# Altium schematic sheet Audio-Beamformer_Driver_V1.0.SchDoc: Audio-Beamformer
size A4; PageSetup: Record=PageOptions|CenterHorizontal=True|CenterVertical=True|PrintScale=0.97|XCorrection=1.00|YCorrection=1.00|PrintKind=0|BorderSize=5000000|LeftOffset=0|BottomOffset=0|Orientation=2|PaperLength=1000|PaperWidth=1000|Scale=100|PaperSource=7|PrintQuality=-3|MediaType=1|DitherType=10|PrintScaleMode=1|PaperKind=A4|PaperIndex=9; Organization: Ostschweizer Fachhochschule; Address2: Florian Baumgartner & Thierry Schwaller; Address3: florian.baumgartner@ost.ch; DocumentNumber: 5; Revision: V1.0; SheetNumber: 5; SheetTotal: 10; Author: Florian Baumgartner & Thierry Schwaller; Subtitle: H-Bridge Driver
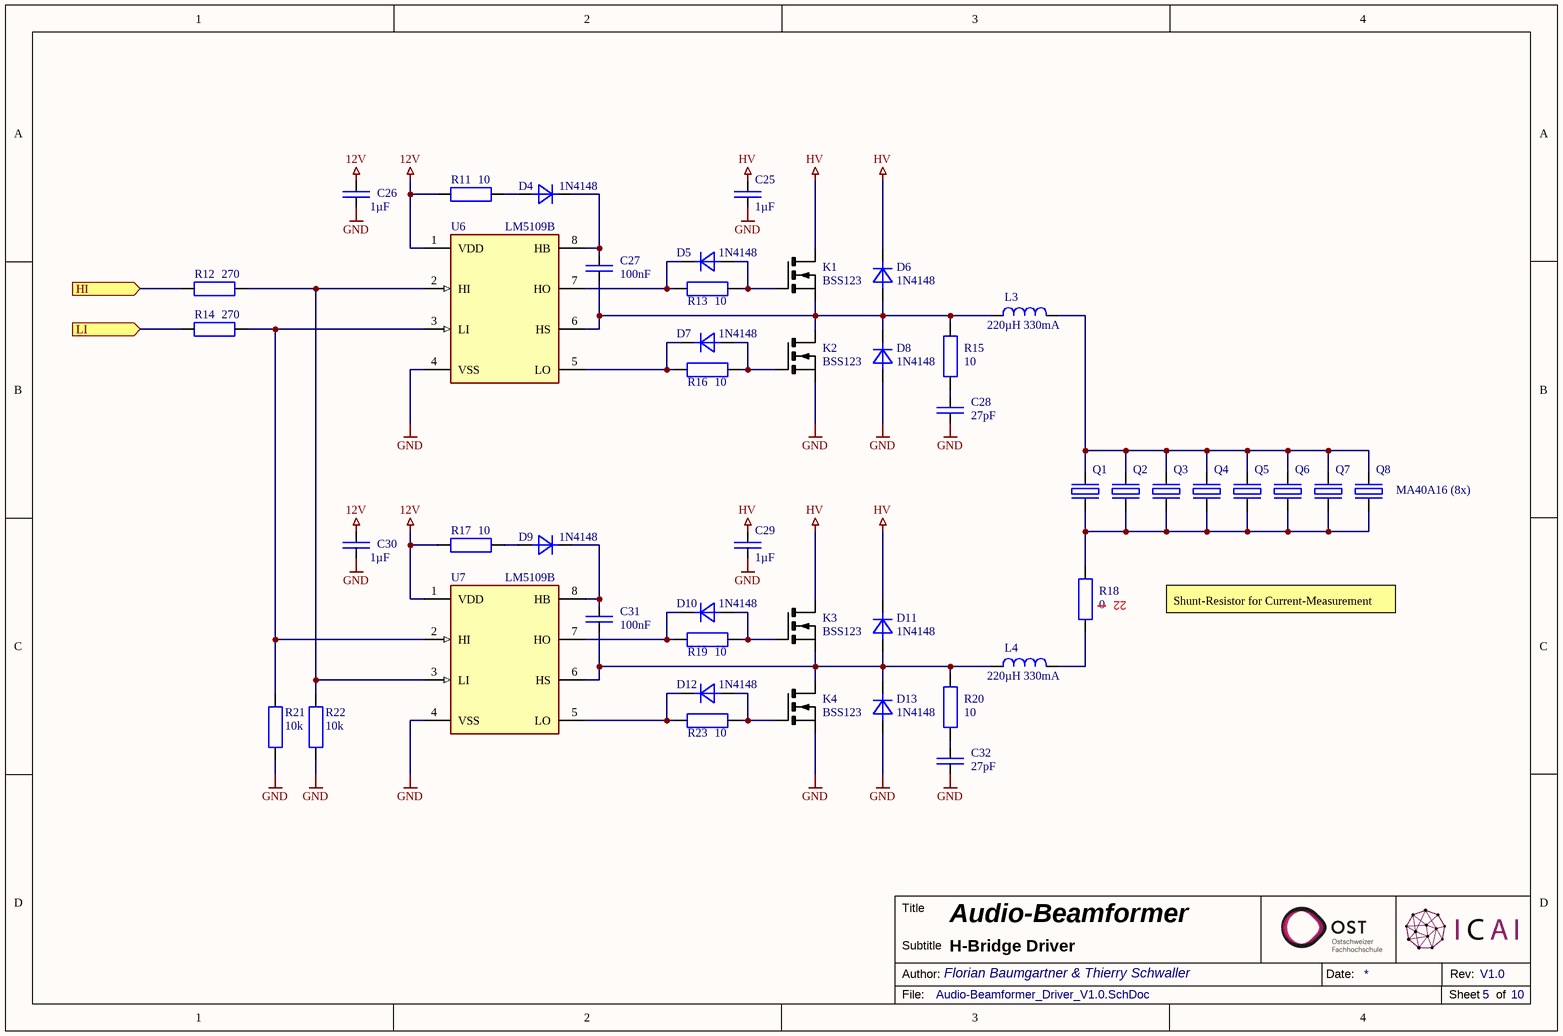
[diagram p0: Audio-Beamformer_Driver_V1.0.SchDoc]

## Parts
C25  1µF  [SMD Keramikkondensator 1206]
C26  1µF  [SMD Keramikkondensator 0603]
C27  100nF  [SMD Keramikkondensator 0603]
C28  27pF  [SMD Keramikkondensator 0603]
C29  1µF  [SMD Keramikkondensator 1206]
C30  1µF  [SMD Keramikkondensator 0603]
C31  100nF  [SMD Keramikkondensator 0603]
C32  27pF  [SMD Keramikkondensator 0603]
D4  1N4148  [SMD Diode SOD-123]
D5  1N4148  [SMD Diode SOD-123]
D6  1N4148  [SMD Diode SOD-123]
D7  1N4148  [SMD Diode SOD-123]
D8  1N4148  [SMD Diode SOD-123]
D9  1N4148  [SMD Diode SOD-123]
D10  1N4148  [SMD Diode SOD-123]
D11  1N4148  [SMD Diode SOD-123]
D12  1N4148  [SMD Diode SOD-123]
D13  1N4148  [SMD Diode SOD-123]
K1  BSS123  [SMD MOSFET SOT-23]
K2  BSS123  [SMD MOSFET SOT-23]
K3  BSS123  [SMD MOSFET SOT-23]
K4  BSS123  [SMD MOSFET SOT-23]
L3  220µH 330mA  [SMD Inductor 7x7x4.5]
L4  220µH 330mA  [SMD Inductor 7x7x4.5]
Q1  MA40A16  [THT Transducer (MA40A16) (5mm Offset)]  (value not drawn)
Q2  MA40A16  [THT Transducer (MA40A16) (5mm Offset)]  (value not drawn)
Q3  MA40A16  [THT Transducer (MA40A16) (5mm Offset)]  (value not drawn)
Q4  MA40A16  [THT Transducer (MA40A16) (5mm Offset)]  (value not drawn)
Q5  MA40A16  [THT Transducer (MA40A16) (5mm Offset)]  (value not drawn)
Q6  MA40A16  [THT Transducer (MA40A16) (5mm Offset)]  (value not drawn)
Q7  MA40A16  [THT Transducer (MA40A16) (5mm Offset)]  (value not drawn)
Q8  MA40A16  [THT Transducer (MA40A16) (5mm Offset)]  (value not drawn)
R11  10  [SMD Widerstand 0603]
R12  270  [SMD Widerstand 0603]
R13  10  [SMD Widerstand 0603]
R14  270  [SMD Widerstand 0603]
R15  10  [SMD Widerstand 1206]
R16  10  [SMD Widerstand 0603]
R17  10  [SMD Widerstand 0603]
R18  0  [SMD Widerstand 1206]
R19  10  [SMD Widerstand 0603]
R20  10  [SMD Widerstand 1206]
R21  10k  [SMD Widerstand 0603]
R22  10k  [SMD Widerstand 0603]
R23  10  [SMD Widerstand 0603]
U6  LM5109B  [SMD IC SOIC-8]
U7  LM5109B  [SMD IC SOIC-8]

## Ports
HI (in), LI (in)

## Nets
12V: C26.2 C30.2 R11.2 R17.2 U6.1(VDD) U7.1(VDD)
GND: C25.1 C26.1 C28.2 C29.1 C30.1 C32.2 D8.A D13.A K2.S K4.S R21.1 R22.1 U6.4(VSS) U7.4(VSS)
HV: C25.2 C29.2 D6.K D11.K K1.D K3.D
HI: R12.1 ; port HI
LI: R14.1 ; port LI
NetC27_1: C27.1 D6.A D8.K K1.S K2.D L3.1 R15.2 U6.6(HS)
NetC27_2: C27.2 D4.K U6.8(HB)
NetC28_1: C28.1 R15.1
NetC31_1: C31.1 D11.A D13.K K3.S K4.D L4.1 R20.2 U7.6(HS)
NetC31_2: C31.2 D9.K U7.8(HB)
NetC32_1: C32.1 R20.1
NetD4_A: D4.A R11.1
NetD5_A: D5.A K1.G R13.1
NetD5_K: D5.K R13.2 U6.7(HO)
NetD7_A: D7.A K2.G R16.1
NetD7_K: D7.K R16.2 U6.5(LO)
NetD9_A: D9.A R17.1
NetD10_A: D10.A K3.G R19.1
NetD10_K: D10.K R19.2 U7.7(HO)
NetD12_A: D12.A K4.G R23.1
NetD12_K: D12.K R23.2 U7.5(LO)
NetL3_2: L3.2 Q1.2 Q2.2 Q3.2 Q4.2 Q5.2 Q6.2 Q7.2 Q8.2
NetL4_2: L4.2 R18.1
NetQ1_1: Q1.1 Q2.1 Q3.1 Q4.1 Q5.1 Q6.1 Q7.1 Q8.1 R18.2
NetR12_2: R12.2 R22.2 U6.2(HI) U7.3(LI)
NetR14_2: R14.2 R21.2 U6.3(LI) U7.2(HI)

## Notes on the sheet
- (near Q8) MA40A16 (8x)
- (near R18) 22
- Shunt-Resistor for Current-Measurement
- Title
- Author:
- Subtitle
- Date:
- Rev:
- File:
- Sheet
- of

## Library data of the parts
C25 C29 = C-CAPACITOR: CAP-MK; Component Description: Multilayer Ceramic Capacitors; Component Value: 1µF 100V; Digikey: 720-VJ1206Y104MXBATCT-ND; Farnell: 1657939; Mouser: 77-VJ1206Y104MXBAT; JLC-Parts: C91151; Unit Price: 0.01
C26 C30 = C-CAPACITOR: CAP-MK; Component Description: Multilayer Ceramic Capacitors; Component Value: 1µF 50V; Digikey: 1276-1860-1-ND; Farnell: 3013383; Mouser: 187-CL10A105KB8NNNC; JLC-Parts: C15849; Unit Price: 0.01
C27 C31 = C-CAPACITOR: CAP-MK; Component Description: Multilayer Ceramic Capacitors; Component Value: 100nF 50V; Digikey: 445-5666-1-ND; Farnell: 2522432; Mouser: 77-VJ0603V104ZXAPBC; JLC-Parts: C14663; Unit Price: 0.01
C28 C32 = C-CAPACITOR: CAP-MK; Component Description: Multilayer Ceramic Capacitors; Component Value: 27pF 50V; Digikey: 399-C0603C270J5GAC7867CT-ND; Farnell: 1414627; Mouser: 80-C0603C270J5G; JLC-Parts: C1656; Unit Price: 0.01
D4-D13 = R-DIODE: DIODE (alt V); Component Description: Fast Switching Diode; Component Value: 1N4148WTR; Digikey: 1655-1360-1-ND; Farnell: 2306363; Mouser: 750-1N4148W-HF; ComponentLink1Description: Datasheet; ComponentLink1URL: https://datasheet.lcsc.com/lcsc/1811061725_ST-Semtech-1N4148W_C81598.pdf; JLC-Parts: C81598; Unit Price: 0.01
K1-K4 = K-FET:NIGE: MOSFET N-Channel; Digikey: 3191-BSS123-F2-0000HFCT-ND; Farnell: 3755132; Mouser: 726-BSS123NH6433; Component Description: MOSFET N-Channel; ComponentLink1Description: Datasheet; ComponentLink1URL: https://datasheet.lcsc.com/lcsc/1912111437_BORN-BSS123_C431506.pdf; Component Value: BSS123; JLC-Parts: C431506; Unit Price: 0.02
L3 L4 = L-COIL: Shielded Power Inductor; Component Value: SLF7045T-221MR33-PF (220µH 330mA); ComponentLink1Description: Datasheet; ComponentLink1URL: https://datasheet.lcsc.com/lcsc/1810010112_TDK-SLF7045T-221MR33-PF_C24679.pdf; Digikey: 445-1210-1-ND; Farnell: 2215715; JLC-Parts: C24679; Mouser: 810-SLF7045T-221M; Component Description: Shielded Power Inductor; Unit Price: 0.32
Q1-Q8 = Q-Piezo: Ultrasonic Transducer; Component Value: MA40A16 (40kHz, 16mm); Component Description: Ultrasonic Transducer; Unit Price: 0.40
R11 R13 R16 R17 R19 R23 = R-RESISTOR: RES (E=Heizwiderstand B=Messwandler); Component Description: Thick Film Chip Resistor; Component Value: 10 (75V, 100mW, 1%); Digikey: P10.0HCT-ND; Farnell: 2302958; Mouser: 667-ERJ-3EKF10R0V; JLC-Parts: C22859; Unit Price: 0.01
R12 R14 = R-RESISTOR: SMD-Widerstand 1/4W; Component Description: Thick Film Chip Resistor; Component Value: 270 (75V, 100mW, 1%); Digikey: P270HCT-ND; Farnell: 2303096; Mouser: 667-ERJ-3EKF2700V; JLC-Parts: C22966; Unit Price: 0.06
R15 R20 = R-RESISTOR: RES (E=Heizwiderstand B=Messwandler); Component Description: Thick Film Chip Resistor; Component Value: 10 (200V, 250mW, 1%); Digikey: P10ECT-ND; Farnell: 2057799; Mouser: 667-ERJ-8GEYJ100V; JLC-Parts: C17903; Unit Price: 0.01
R18 = R-RESISTOR: RES (E=Heizwiderstand B=Messwandler); Component Description: Thick Film Chip Resistor; Component Value: 0 (200V, 250mW, 1%); Digikey: P0.0ECT-ND; Farnell: 2057791; Mouser: 667-ERJ-8GEY0R00V; JLC-Parts: C17888; Unit Price: 0.01
R21 R22 = R-RESISTOR: RES (E=Heizwiderstand B=Messwandler); Component Description: Thick Film Chip Resistor; Component Value: 10k (75V, 100mW, 1%); Digikey: P10.0KHCT-ND; Farnell: 2303192; Mouser: 667-ERJ-3EKF1002V; JLC-Parts: C25804; Unit Price: 0.01
U6 U7 = U-LM5109B: High Voltage 1A Peak Half Bridge Gate Driver; Component Description: High Voltage Gate Driver; ComponentLink1Description: Datasheet; ComponentLink1URL: https://datasheet.lcsc.com/lcsc/1809172040_Texas-Instruments-LM5109AMAX-NOPB_C129332.pdf; Digikey: LM5109BMA/NOPB-ND; Component Value: LM5109B; Farnell: 3005776; JLC-Parts: C116862; Mouser: 926-LM5109BMAX/NOPB; Unit Price: 1.13